# Altium schematic sheet Isolated Interface.SchDoc
size 420 x 297 mm; DocumentNumber: 2; SheetNumber: 3; SheetTotal: 3
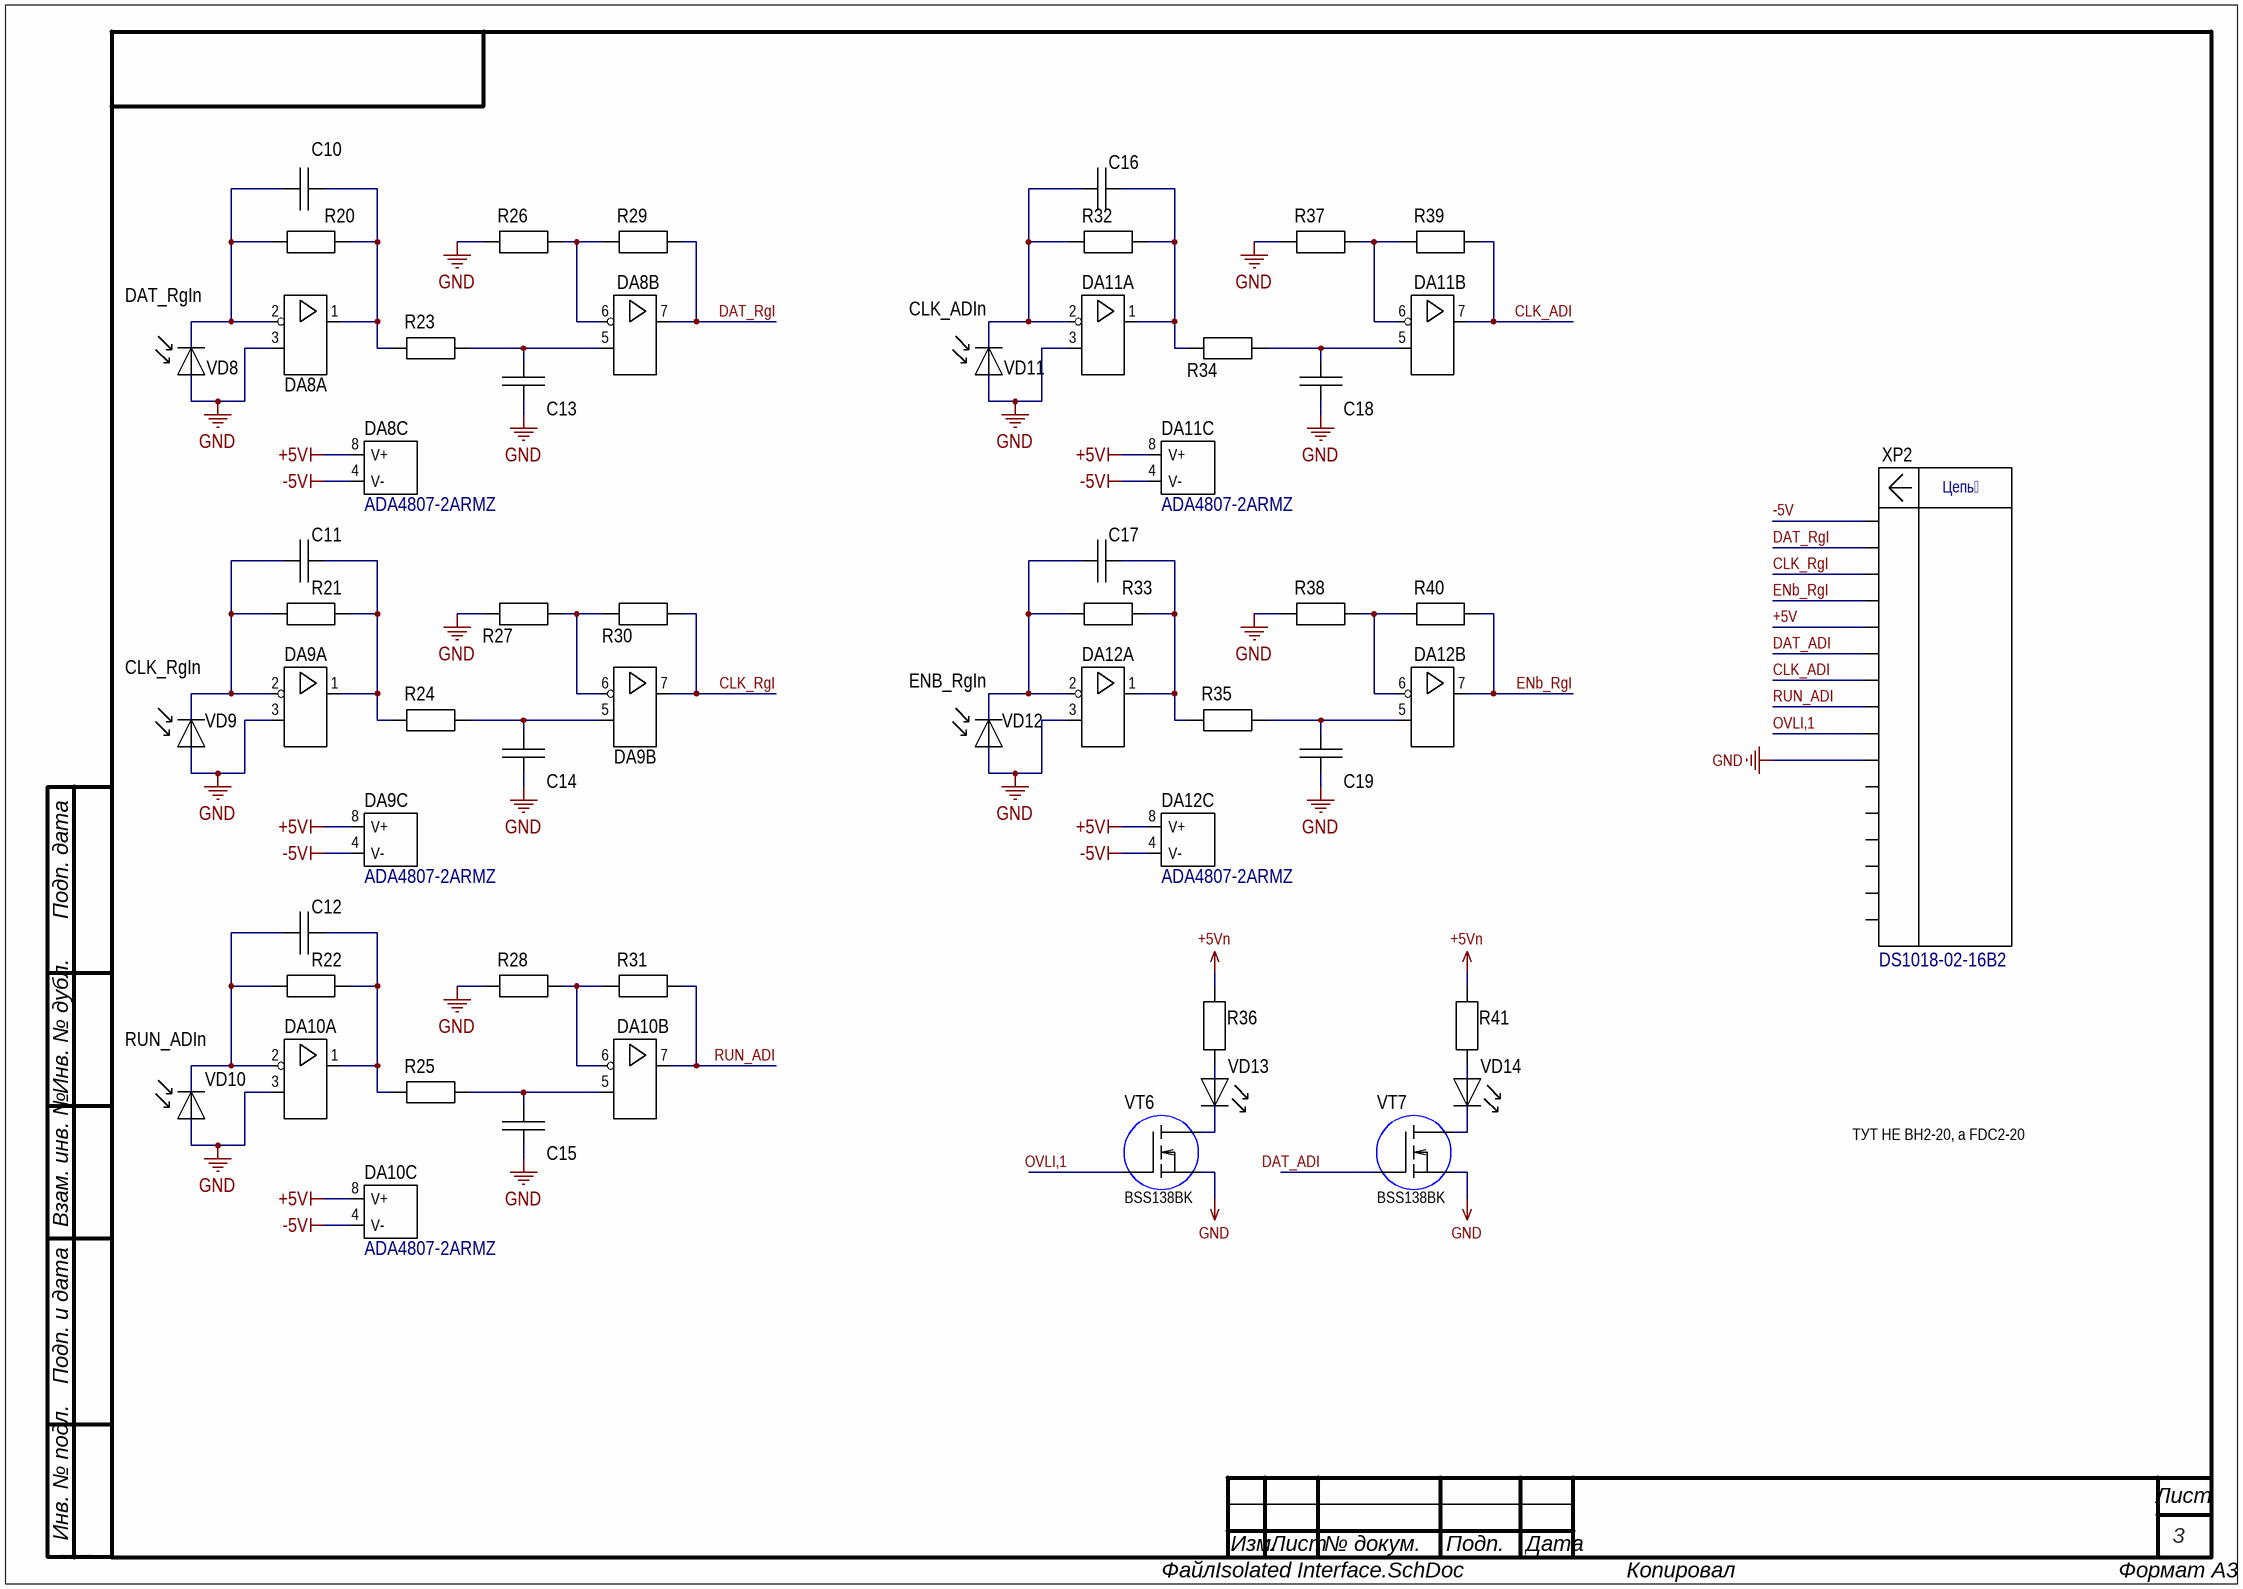
[diagram p0: Isolated Interface.SchDoc]

## Parts
C10  0805-NP0-50 В-2,4 пФ-1%  [CAP: 0805]  (value not drawn)
C11  0805-NP0-50 В-2,4 пФ-1%  [CAP: 0805]  (value not drawn)
C12  0805-NP0-50 В-2,4 пФ-1%  [CAP: 0805]  (value not drawn)
C13  1206-С0G-50 B-56 пФ+-1%  [CAP: 1206]  (value not drawn)
C14  1206-С0G-50 B-56 пФ+-1%  [CAP: 1206]  (value not drawn)
C15  1206-С0G-50 B-56 пФ+-1%  [CAP: 1206]  (value not drawn)
C16  0805-NP0-50 В-2,4 пФ-1%  [CAP: 0805]  (value not drawn)
C17  0805-NP0-50 В-2,4 пФ-1%  [CAP: 0805]  (value not drawn)
C18  1206-С0G-50 B-56 пФ+-1%  [CAP: 1206]  (value not drawn)
C19  1206-С0G-50 B-56 пФ+-1%  [CAP: 1206]  (value not drawn)
DA8  ADA4807-2ARMZ  [8-MSOP]  (value not drawn)  (parts A,B,C of 3)
DA9  ADA4807-2ARMZ  [8-MSOP]  (value not drawn)  (parts A,B,C of 3)
DA10  ADA4807-2ARMZ  [8-MSOP]  (value not drawn)  (parts A,B,C of 3)
DA11  ADA4807-2ARMZ  [8-MSOP]  (value not drawn)  (parts A,B,C of 3)
DA12  ADA4807-2ARMZ  [8-MSOP]  (value not drawn)  (parts A,B,C of 3)
R20  1206-5,23 кОм+-1%  [1206]  (value not drawn)
R21  1206-5,23 кОм+-1%  [1206]  (value not drawn)
R22  1206-5,23 кОм+-1%  [1206]  (value not drawn)
R23  1206-140 Ом+-1%  [1206]  (value not drawn)
R24  1206-140 Ом+-1%  [1206]  (value not drawn)
R25  1206-140 Ом+-1%  [1206]  (value not drawn)
R26  1206-102 Ом+-1%  [1206]  (value not drawn)
R27  1206-102 Ом+-1%  [1206]  (value not drawn)
R28  1206-102 Ом+-1%  [1206]  (value not drawn)
R29  1206-215 Ом+-1%  [1206]  (value not drawn)
R30  1206-215 Ом+-1%  [1206]  (value not drawn)
R31  1206-215 Ом+-1%  [1206]  (value not drawn)
R32  1206-5,23 кОм+-1%  [1206]  (value not drawn)
R33  1206-5,23 кОм+-1%  [1206]  (value not drawn)
R34  1206-140 Ом+-1%  [1206]  (value not drawn)
R35  1206-140 Ом+-1%  [1206]  (value not drawn)
R36  1206-30 Ом+-5%  [1206]  (value not drawn)
R37  1206-102 Ом+-1%  [1206]  (value not drawn)
R38  1206-102 Ом+-1%  [1206]  (value not drawn)
R39  1206-215 Ом+-1%  [1206]  (value not drawn)
R40  1206-215 Ом+-1%  [1206]  (value not drawn)
R41  1206-30 Ом+-5%  [1206]  (value not drawn)
VD8  SFH203  [SFH203]  (value not drawn)
VD9  SFH203  [SFH203]  (value not drawn)
VD10  SFH203  [SFH203]  (value not drawn)
VD11  SFH203  [SFH203]  (value not drawn)
VD12  SFH203  [SFH203]  (value not drawn)
VD13  VSMY2853RG  [VSMY2853G]  (value not drawn)
VD14  VSMY2853RG  [VSMY2853G]  (value not drawn)
VT6  BSS138BK  [SOT-23-3]
VT7  BSS138BK  [SOT-23-3]
XP2  DS1018-02-16B2  [DS1018-02-16B2]

## Nets
+5V: DA8.8(V+) DA9.8(V+) DA10.8(V+) DA11.8(V+) DA12.8(V+) XP2.5
+5Vn: R36.2 R41.2
-5V: DA8.4(V-) DA9.4(V-) DA10.4(V-) DA11.4(V-) DA12.4(V-) XP2.1
GND: C13.1 C14.1 C15.1 C18.1 C19.1 DA8.3(+IN_A) DA9.3(+IN_A) DA10.3(+IN_A) DA11.3(+IN_A) DA12.3(+IN_A) R26.1 R27.1 R28.1 R37.1 R38.1 VD8.1 VD9.1 VD10.1 VD11.1 VD12.1 VT6.2(S) VT7.2(S) XP2.10
CLK_ADI: DA11.7(OUT_B) R39.2 XP2.7
CLK_RgI: DA9.7(OUT_B) R30.2 XP2.3
DAT_ADI: VT7.1(G) XP2.6
DAT_RgI: DA8.7(OUT_B) R29.2 XP2.2
ENb_RgI: DA12.7(OUT_B) R40.2 XP2.4
OVLI,1: VT6.1(G) XP2.9
RUN_ADI: DA10.7(OUT_B) R31.2 XP2.8
NetC10_1: C10.1 DA8.2(-IN_A) R20.1 VD8.2
NetC10_2: C10.2 DA8.1(OUT_A) R20.2 R23.1
NetC11_1: C11.1 DA9.2(-IN_A) R21.1 VD9.2
NetC11_2: C11.2 DA9.1(OUT_A) R21.2 R24.1
NetC12_1: C12.1 DA10.2(-IN_A) R22.1 VD10.2
NetC12_2: C12.2 DA10.1(OUT_A) R22.2 R25.1
NetC13_2: C13.2 DA8.5(+IN_B) R23.2
NetC14_2: C14.2 DA9.5(+IN_B) R24.2
NetC15_2: C15.2 DA10.5(+IN_B) R25.2
NetC16_1: C16.1 DA11.2(-IN_A) R32.1 VD11.2
NetC16_2: C16.2 DA11.1(OUT_A) R32.2 R34.1
NetC17_1: C17.1 DA12.2(-IN_A) R33.1 VD12.2
NetC17_2: C17.2 DA12.1(OUT_A) R33.2 R35.1
NetC18_2: C18.2 DA11.5(+IN_B) R34.2
NetC19_2: C19.2 DA12.5(+IN_B) R35.2
NetDA8_6: DA8.6(-IN_B) R26.2 R29.1
NetDA9_6: DA9.6(-IN_B) R27.2 R30.1
NetDA10_6: DA10.6(-IN_B) R28.2 R31.1
NetDA11_6: DA11.6(-IN_B) R37.2 R39.1
NetDA12_6: DA12.6(-IN_B) R38.2 R40.1
NetR36_1: R36.1 VD13.1(Anode)
NetR41_1: R41.1 VD14.1(Anode)
NetVD13_2: VD13.2(Cathode) VT6.3(D)
NetVD14_2: VD14.2(Cathode) VT7.3(D)

Not connected (* = marked no-connect by the designer): XP2 11 12 13 14 15 16

## Notes on the sheet
- (near VD8) DAT_RgIn
- (near VD11) CLK_ADIn
- (near VD9) CLK_RgIn
- (near VD12) ENB_RgIn
- (near VD10) RUN_ADIn
- ТУТ НЕ BH2-20, а FDC2-20
- Подп. дата
- Инв. № дубл.
- Взам. инв. №
- Подп. и дата
- Инв. № подл.
- Изм.
- Лист
- № докум.
- Подп.
- Дата
- ALTIUM GOSTBOM2.0 KEV
- Файл:
- Копировал
- Формат А3
- (in symbol DS1018-02-16B2) Цепь

## Library data of the parts
C10-C12 C16 C17 = 0805-NP0-50 В-2,4 пФ-1%: Value: 2,1 мкФ
C13-C15 C18 C19 = 1206-С0G-50 B-56 пФ+-1%: Value: 56 пФ
DA8-DA12 = ADA4807-2ARMZ: 3.1 nV/√Hz, 1 mA, 180 MHz, / Rail-to-Rail Input/Output Amplifiers
R23-R25 R34 R35 = 1206-140 Ом+-1%: Value: 140 Ом; ModelPrint: 1206
R26-R28 R37 R38 = 1206-102 Ом+-1%: Value: 102 Ом; ModelPrint: 1206
R29-R31 R39 R40 = 1206-215 Ом+-1%: Value: 215 Ом; ModelPrint: 1206
R36 R41 = 1206-30 Ом+-5%: Value: 30 Ом; ModelPrint: 1206
VD8-VD12 = SFH203: Silicon PIN Photodiode
VD13 VD14 = VSMY2853RG: High Speed Infrared Emitting Diodes, 850 nm, / Surface Emitter Technology
VT6 VT7 = BSS138BK: 60 V, 360 mA N-channel Trench MOSFET
XP2 = DS1018-02-16B2: pitch 2mm, 20 pin 2x10
R20-R22 R32 R33 = 1206-5,23 кОм+-1%: ModelPrint: 1206; Value: 5,23 кОм